# EAGLE design +XPanel (EAGLE 9.5.1)
DESIGNER: Reid Collins; PART_NUMBER: 68-0006; PROJECT: CougSat-1: +X Panel; REV: 1.1.1
Assembly variants: Main

## Sheet 1 of 4
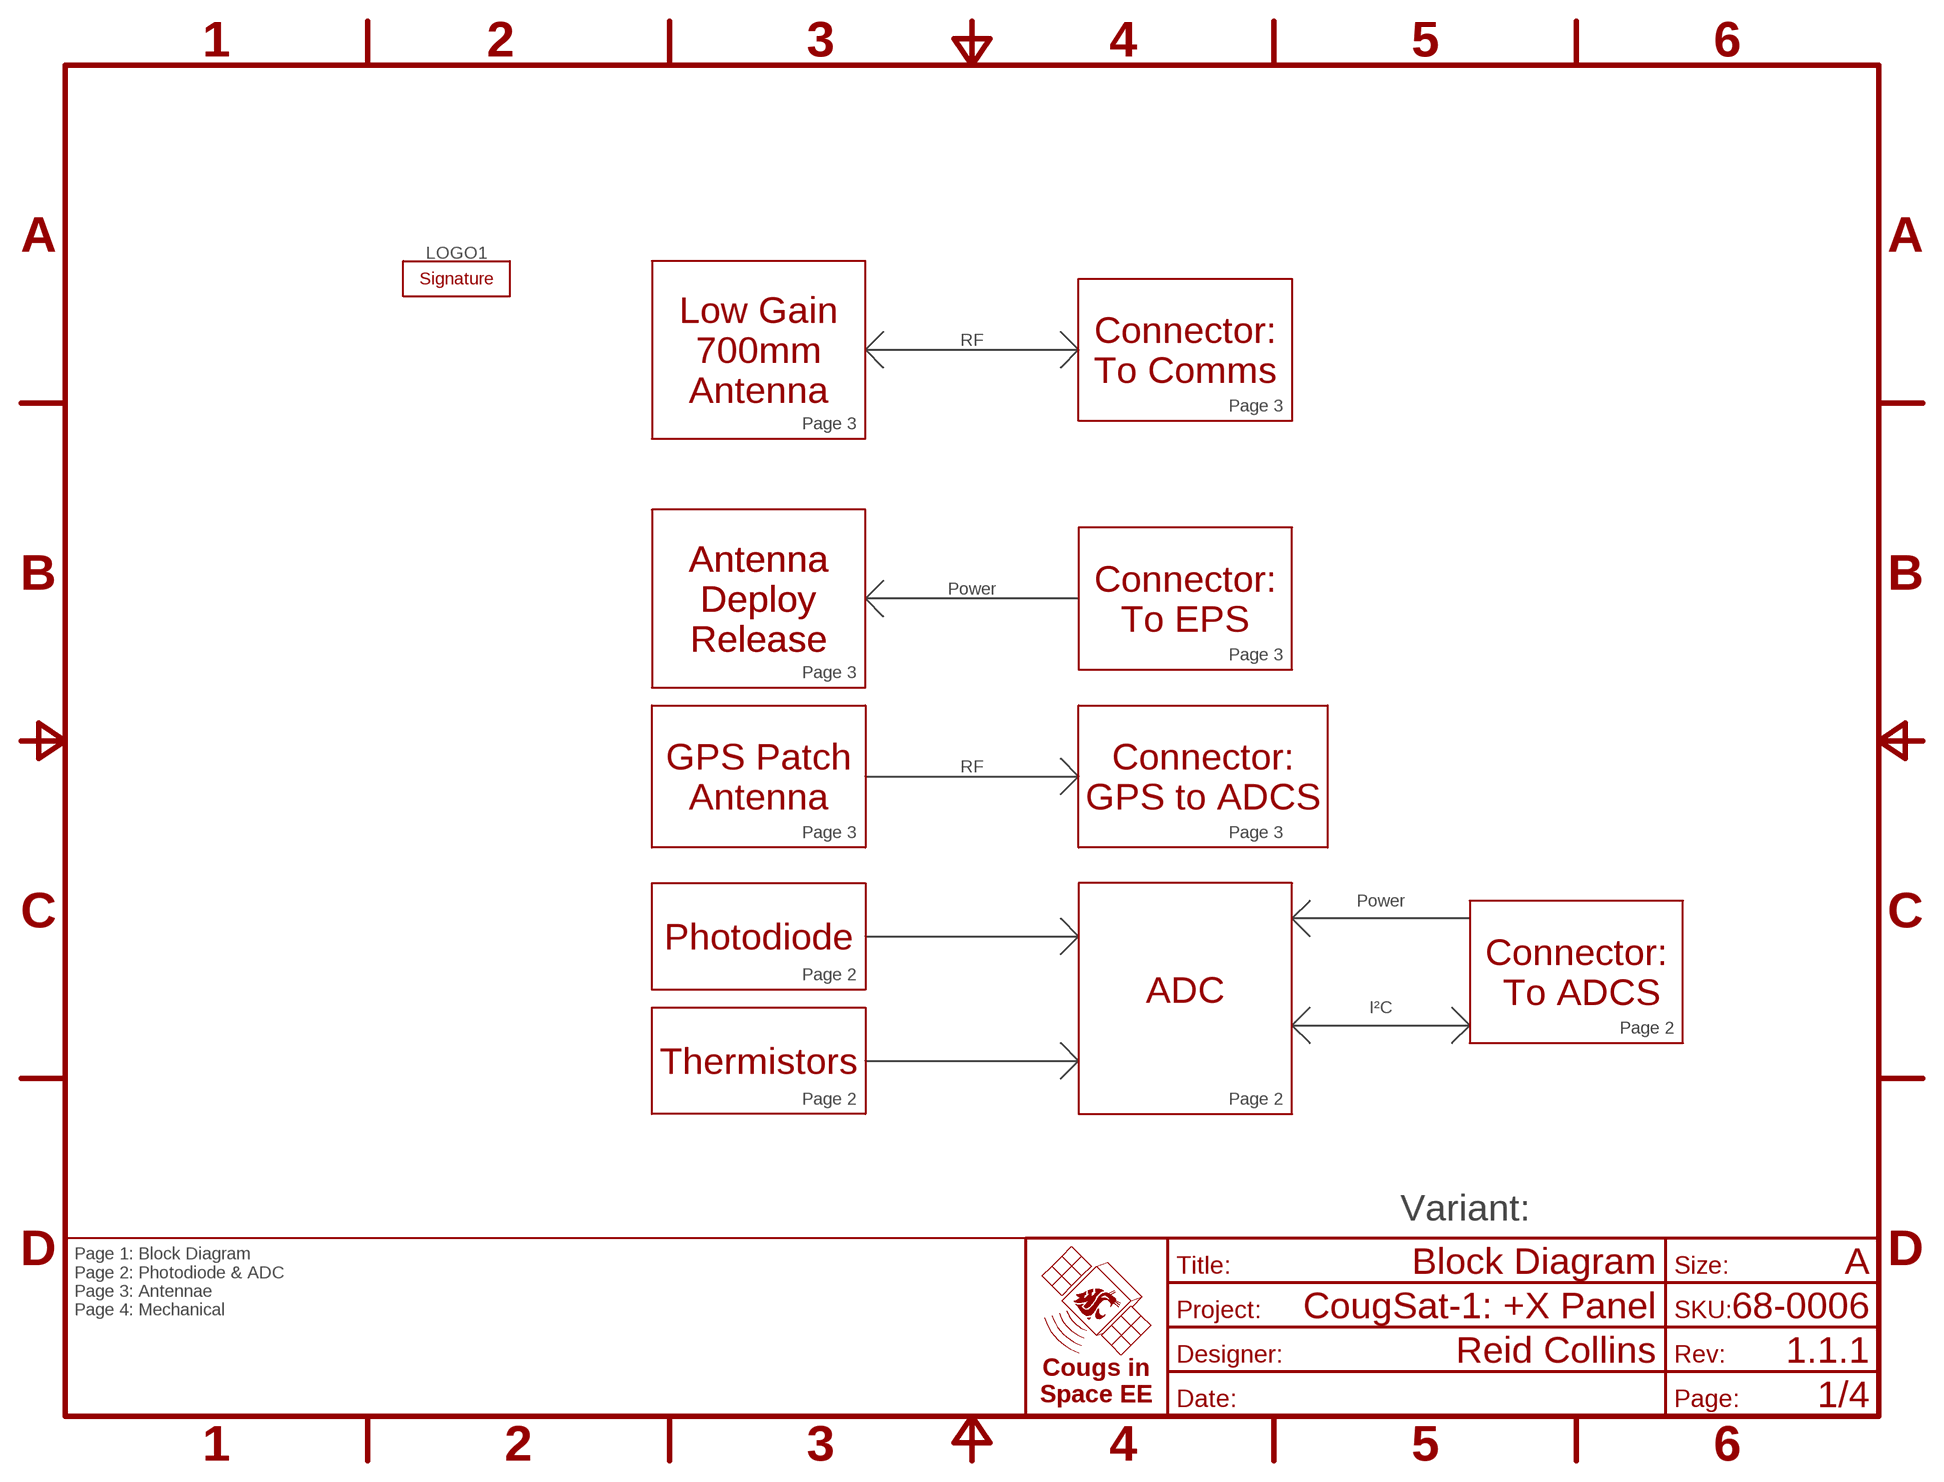
[diagram p0: schematic, sheet 1]
FRAME1 (FRAME-A): TITLE: Block Diagram

### Parts
LOGO1  SIGNATUREJAYSON  [SIGN-JAYSON]

### Notes on the sheet
- RF
- Low Gain
  700mm
  Antenna
- Connector:
  To Comms
- Page 3
- Page 3
- Power
- Antenna
  Deploy
  Release
- Antenna
  Deploy
  Release
- Connector:
  To EPS
- Page 3
- Page 3
- RF
- GPS Patch
  Antenna
- Connector:
  GPS to ADCS
- Page 3 | Page 3
- Power
- Photodiode
- Connector:
   To ADCS
- Page 2
- ADC
- I²C
- Page 2
- Thermistors
- Page 2 | Page 2
- Variant:
- Page 1: Block Diagram
  Page 2: Photodiode & ADC
  Page 3: Antennae
  Page 4: Mechanical

## Sheet 2 of 4
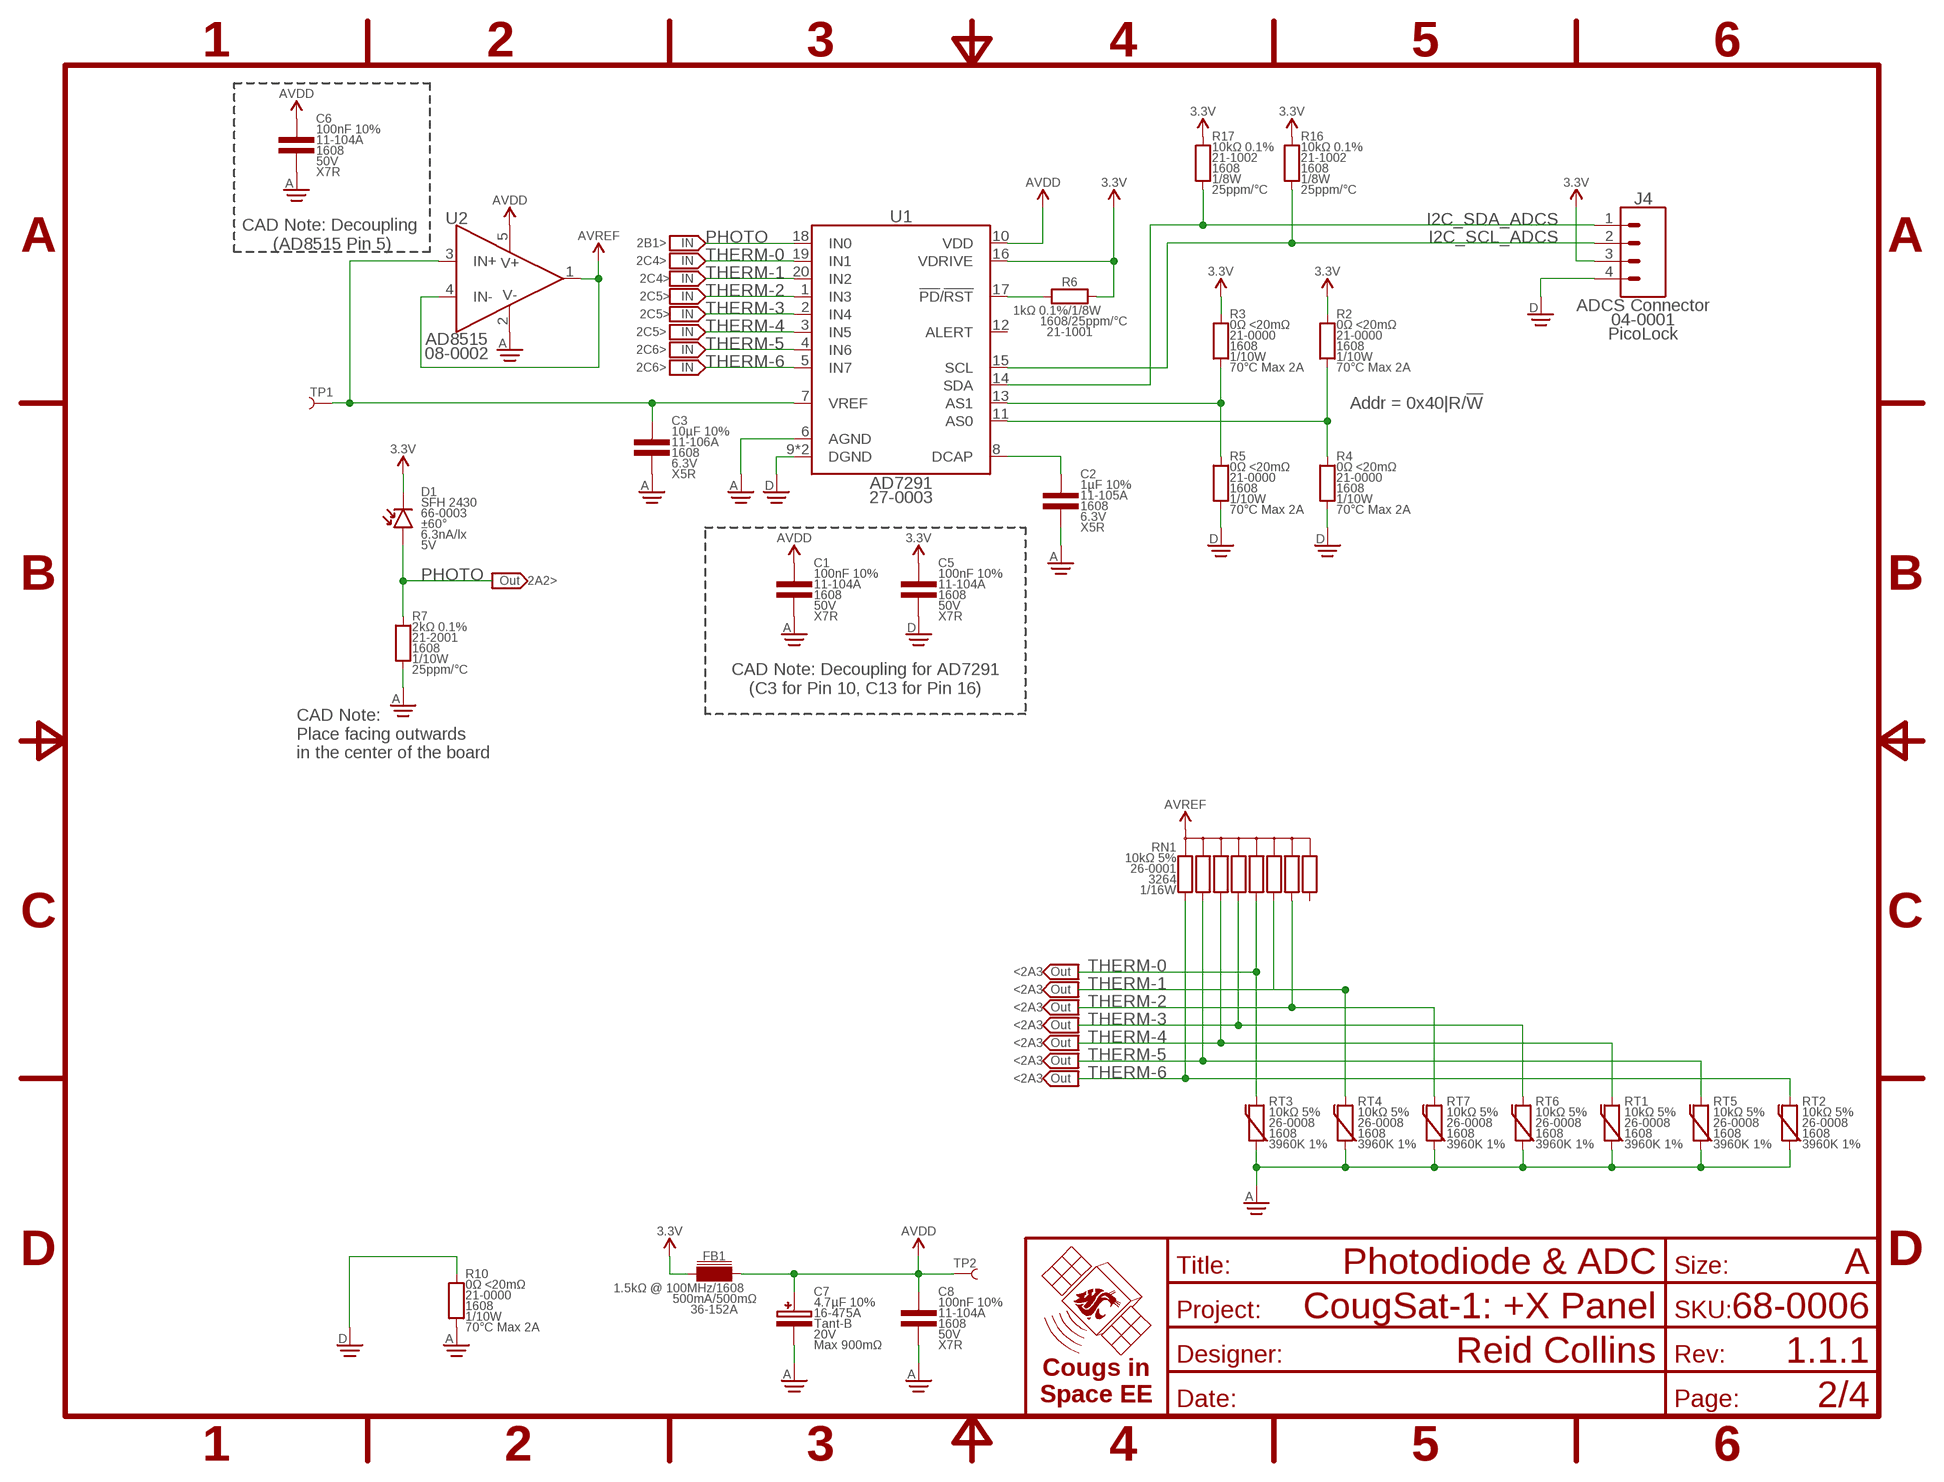
[diagram p1: schematic, sheet 2]
FRAME2 (FRAME-A): TITLE: Photodiode & ADC

### Parts
C1  100nF 10%  CAP-V-100NF-1608  [1608]
C2  1µF 10%  CAP-V-1UF-1608  [1608]
C3  10µF 10%  CAP-V-10UF-1608  [1608]
C5  100nF 10%  CAP-V-100NF-1608  [1608]
C6  100nF 10%  CAP-V-100NF-1608  [1608]
C7  4.7µF 10%  CAP-POL-V-4.7UF-4028  [4028-POL]
C8  100nF 10%  CAP-V-100NF-1608  [1608]
D1  SFH 2430  PHOTODIODE-SFH2430  [SFH2430]
FB1  1.5kΩ @ 100MHz  CHOKE-H-1.5K-1608  [1608]
J4  ADCS Connector  1X04-PICOLOCK  [PICOLOCK1.5-04]
R2  0Ω <20mΩ  RES-V-0-1608  [1608]
R3  0Ω <20mΩ  RES-V-0-1608  [1608]
R4  0Ω <20mΩ  RES-V-0-1608  [1608]  (not fitted in variant Main)
R5  0Ω <20mΩ  RES-V-0-1608  [1608]  (not fitted in variant Main)
R6  1kΩ 0.1%  RES-H-1K-1608  [1608]
R7  2kΩ 0.1%  RES-V-2K-1608  [1608]
R10  0Ω <20mΩ  RES-V-0-1608  [1608]
R16  10kΩ 0.1%  RES-V-10K-1608  [1608]  (not fitted in variant Main)
R17  10kΩ 0.1%  RES-V-10K-1608  [1608]  (not fitted in variant Main)
RN1  10kΩ 5%  RES_BUS-10-10K-3264  [3264]
RT1  10kΩ 5%  THERMISTOR-V-10K-1608  [1608]
RT2  10kΩ 5%  THERMISTOR-V-10K-1608  [1608]
RT3  10kΩ 5%  THERMISTOR-V-10K-1608  [1608]
RT4  10kΩ 5%  THERMISTOR-V-10K-1608  [1608]
RT5  10kΩ 5%  THERMISTOR-V-10K-1608  [1608]
RT6  10kΩ 5%  THERMISTOR-V-10K-1608  [1608]
RT7  10kΩ 5%  THERMISTOR-V-10K-1608  [1608]
TP1  TEST_POINT-SMD-C-1.25  [SMD-C-1.25]
TP2  TEST_POINT-SMD-C-1.25  [SMD-C-1.25]
U1  AD7291  [QFN-20-4040]
U2  AD8515  OPAMP-1-AD8515  [SOT23-5]

### Nets
3.3V: C5.1 D1.C FB1.1 J4.3 R2.2 R3.2 R6.2 R16.2 R17.2 U1.16(VDRIVE)
ADC_AS0: R2.1 R4.2 U1.11(AS0)
ADC_AS1: R3.1 R5.2 U1.13(AS1)
AGND: C1.2 C2.2 C3.2 C6.2 C7.C C8.2 R7.1 R10.1 RT1.1 RT2.1 RT3.1 RT4.1 RT5.1 RT6.1 RT7.1 U1.6(AGND) U2.2(V-)
AVDD: C1.1 C6.1 C7.A C8.1 FB1.2 TP2.1 U1.10(VDD) U2.5(V+)
AVREF: RN1.5(C) RN1.10(C) U2.1(OUT) U2.4(IN-)
AVREF_UNBUF: C3.1 TP1.1 U1.7(VREF) U2.3(IN+)
DCAP: C2.1 U1.8(DCAP)
DGND: C5.2 J4.4 R4.1 R5.1 R10.2 U1.9(DGND) U1.PAD(DGND)
I2C_SCL_ADCS: J4.2 R16.1 U1.15(SCL)
I2C_SDA_ADCS: J4.1 R17.1 U1.14(SDA)
PD_RST: R6.1 U1.17(!PD!/!RST)
PHOTO: D1.A R7.2 U1.18(IN0)
THERM-0: RN1.6 RT3.2 U1.19(IN1)
THERM-1: RN1.7 RT4.2 U1.20(IN2)
THERM-2: RN1.8 RT7.2 U1.1(IN3)
THERM-3: RN1.4 RT6.2 U1.2(IN4)
THERM-4: RN1.3 RT1.2 U1.3(IN5)
THERM-5: RN1.2 RT5.2 U1.4(IN6)
THERM-6: RN1.1 RT2.2 U1.5(IN7)
Unconnected: RN1.9 U1.12(ALERT)

### Notes on the sheet
- CAD Note: Decoupling 
  (AD8515 Pin 5)
- 2B1>
- 2C4>
- 2C4>
- 2C5>
- 2C5>
- 2C5>
- 2C6>
- 2C6>
- Addr = 0x40|R/!W
- 2A2>
- CAD Note: Decoupling for AD7291
  (C3 for Pin 10, C13 for Pin 16)
- CAD Note: 
  Place facing outwards 
  in the center of the board
- <2A3
- <2A3
- <2A3
- <2A3
- <2A3
- <2A3
- <2A3

## Sheet 3 of 4
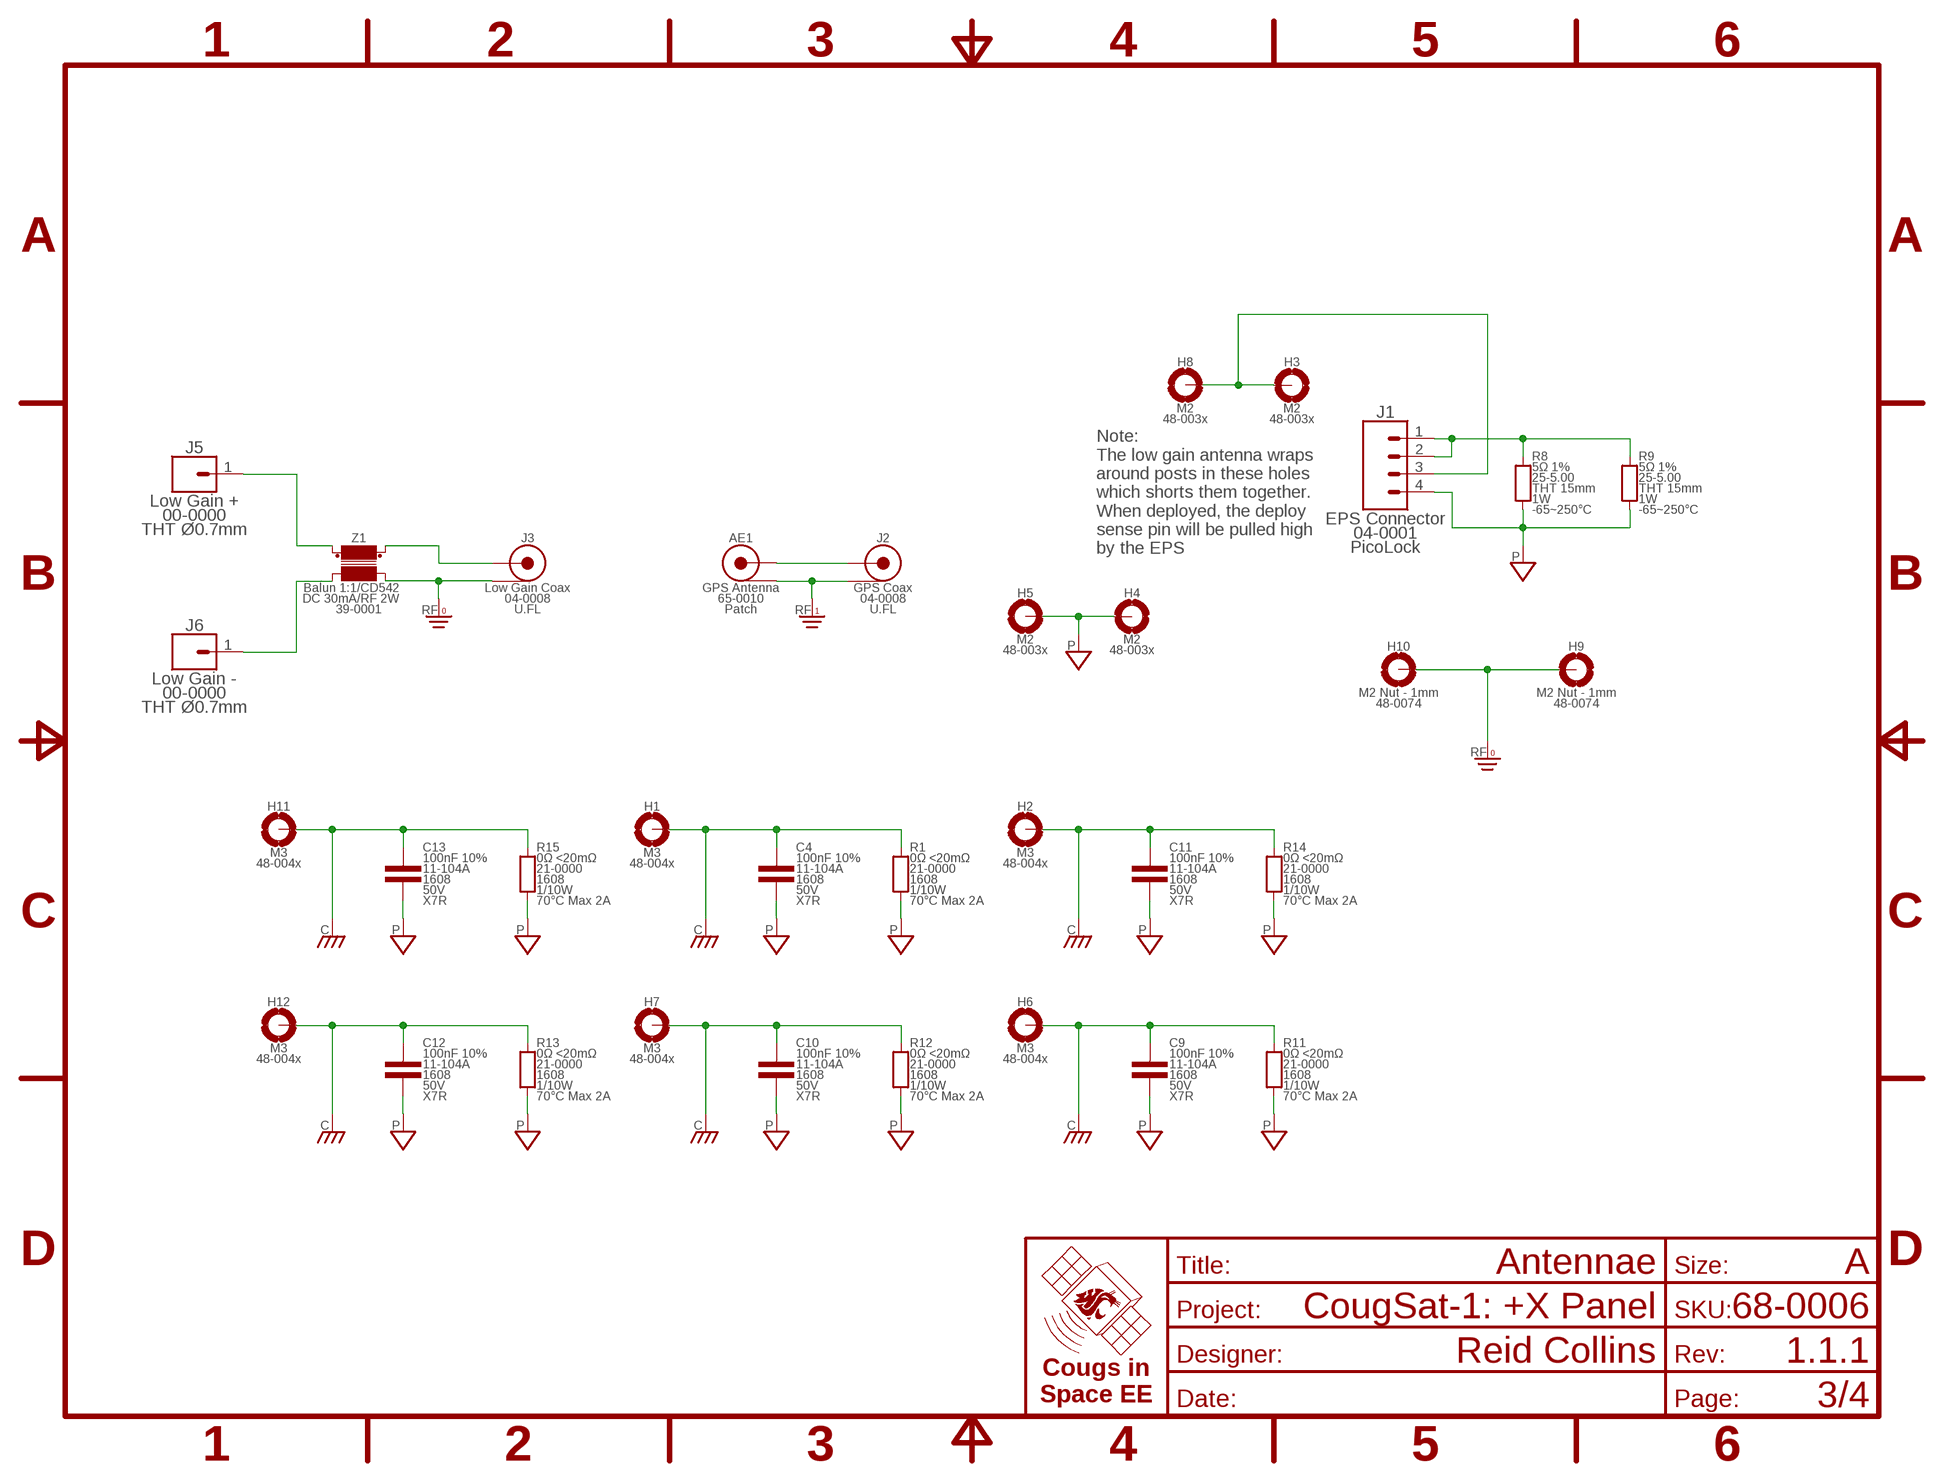
[diagram p2: schematic, sheet 3]
FRAME3 (FRAME-A): TITLE: Antennae

### Parts
AE1  GPS Antenna  ANTENNA-GPSPATCH  [ANTENNA-GPS]
C4  100nF 10%  CAP-V-100NF-1608  [1608]
C9  100nF 10%  CAP-V-100NF-1608  [1608]
C10  100nF 10%  CAP-V-100NF-1608  [1608]
C11  100nF 10%  CAP-V-100NF-1608  [1608]
C12  100nF 10%  CAP-V-100NF-1608  [1608]
C13  100nF 10%  CAP-V-100NF-1608  [1608]
H1  M3  MOUNTING_HOLE-3.3  [MOUNTING_HOLE-3.3]
H2  M3  MOUNTING_HOLE-3.3  [MOUNTING_HOLE-3.3]
H3  M2  MOUNTING_HOLE-2.2  [MOUNTING_HOLE-2.2]
H4  M2  MOUNTING_HOLE-2.2  [MOUNTING_HOLE-2.2]
H5  M2  MOUNTING_HOLE-2.2  [MOUNTING_HOLE-2.2]
H6  M3  MOUNTING_HOLE-3.3  [MOUNTING_HOLE-3.3]
H7  M3  MOUNTING_HOLE-3.3  [MOUNTING_HOLE-3.3]
H8  M2  MOUNTING_HOLE-2.2  [MOUNTING_HOLE-2.2]
H9  M2 Nut - 1mm  MOUNTING_HOLE-1MM-M2_NUT  [MOUNTING_HOLE-M2_NUT]
H10  M2 Nut - 1mm  MOUNTING_HOLE-1MM-M2_NUT  [MOUNTING_HOLE-M2_NUT]
H11  M3  MOUNTING_HOLE-3.3  [MOUNTING_HOLE-3.3]
H12  M3  MOUNTING_HOLE-3.3  [MOUNTING_HOLE-3.3]
J1  EPS Connector  1X04-PICOLOCK  [PICOLOCK1.5-04]
J2  GPS Coax  COAX-U.FL  [U.FL]
J3  Low Gain Coax  COAX-U.FL  [U.FL]
J5  Low Gain +  1X01-THT-0.7  [THT-0.7]
J6  Low Gain -  1X01-THT-0.7  [THT-0.7]
R1  0Ω <20mΩ  RES-V-0-1608  [1608]
R8  5Ω 1%  RES-V-5R-THT-15MM  [THT-15MM]
R9  5Ω 1%  RES-V-5R-THT-15MM  [THT-15MM]
R11  0Ω <20mΩ  RES-V-0-1608  [1608]
R12  0Ω <20mΩ  RES-V-0-1608  [1608]
R13  0Ω <20mΩ  RES-V-0-1608  [1608]
R14  0Ω <20mΩ  RES-V-0-1608  [1608]
R15  0Ω <20mΩ  RES-V-0-1608  [1608]
Z1  Balun 1:1  BALUN-ADTL1-12+-CD542  [CD542]

### Nets
CHASSIS: C4.1 C9.1 C10.1 C11.1 C12.1 C13.1 H1.1(MOUNT) H1.V1(MOUNT) H1.V2(MOUNT) H1.V3(MOUNT) H1.V4(MOUNT) H1.V5(MOUNT) H1.V6(MOUNT) H1.V7(MOUNT) H1.V8(MOUNT) H1.V9(MOUNT) H1.V10(MOUNT) H2.1(MOUNT) H2.V1(MOUNT) H2.V2(MOUNT) H2.V3(MOUNT) H2.V4(MOUNT) H2.V5(MOUNT) H2.V6(MOUNT) H2.V7(MOUNT) H2.V8(MOUNT) H2.V9(MOUNT) H2.V10(MOUNT) H6.1(MOUNT) H6.V1(MOUNT) H6.V2(MOUNT) H6.V3(MOUNT) H6.V4(MOUNT) H6.V5(MOUNT) H6.V6(MOUNT) H6.V7(MOUNT) H6.V8(MOUNT) H6.V9(MOUNT) H6.V10(MOUNT) H7.1(MOUNT) H7.V1(MOUNT) H7.V2(MOUNT) H7.V3(MOUNT) H7.V4(MOUNT) H7.V5(MOUNT) H7.V6(MOUNT) H7.V7(MOUNT) H7.V8(MOUNT) H7.V9(MOUNT) H7.V10(MOUNT) H11.1(MOUNT) H11.V1(MOUNT) H11.V2(MOUNT) H11.V3(MOUNT) H11.V4(MOUNT) H11.V5(MOUNT) H11.V6(MOUNT) H11.V7(MOUNT) H11.V8(MOUNT) H11.V9(MOUNT) H11.V10(MOUNT) H12.1(MOUNT) H12.V1(MOUNT) H12.V2(MOUNT) H12.V3(MOUNT) H12.V4(MOUNT) H12.V5(MOUNT) H12.V6(MOUNT) H12.V7(MOUNT) H12.V8(MOUNT) H12.V9(MOUNT) H12.V10(MOUNT) R1.2 R11.2 R12.2 R13.2 R14.2 R15.2
DEPLOYABLE: J1.1 J1.2 R8.2 R9.2
GPS_COAX [50Ohm]: AE1.CENTER J2.CENTER
LOW_GAIN_COAX [50Ohm]: J3.CENTER Z1.6(SECONDARY-DOT)
LOW_GAIN_N [50Ohm]: J6.1 Z1.3(PRIMARY)
LOW_GAIN_P [50Ohm]: J5.1 Z1.1(PRIMARY-DOT)
PGND: C4.2 C9.2 C10.2 C11.2 C12.2 C13.2 H4.1(MOUNT) H4.V1(MOUNT) H4.V2(MOUNT) H4.V3(MOUNT) H4.V4(MOUNT) H4.V5(MOUNT) H4.V6(MOUNT) H4.V7(MOUNT) H4.V8(MOUNT) H5.1(MOUNT) H5.V1(MOUNT) H5.V2(MOUNT) H5.V3(MOUNT) H5.V4(MOUNT) H5.V5(MOUNT) H5.V6(MOUNT) H5.V7(MOUNT) H5.V8(MOUNT) J1.4 R1.1 R8.1 R9.1 R11.1 R12.1 R13.1 R14.1 R15.1
RFGND-0 [50Ohm]: H9.1(MOUNT) H9.V1(MOUNT) H9.V2(MOUNT) H9.V3(MOUNT) H9.V4(MOUNT) H9.V5(MOUNT) H9.V6(MOUNT) H9.V7(MOUNT) H9.V8(MOUNT) H10.1(MOUNT) H10.V1(MOUNT) H10.V2(MOUNT) H10.V3(MOUNT) H10.V4(MOUNT) H10.V5(MOUNT) H10.V6(MOUNT) H10.V7(MOUNT) H10.V8(MOUNT) J3.SHIELD@1(SHIELD) J3.SHIELD@2(SHIELD) J3.SHIELD@13(SHIELD) Z1.4(SECONDARY)
RFGND-1 [50Ohm]: AE1.GND(SHIELD) J2.SHIELD@1(SHIELD) J2.SHIELD@2(SHIELD) J2.SHIELD@13(SHIELD)
SENSE: H3.1(MOUNT) H3.V1(MOUNT) H3.V2(MOUNT) H3.V3(MOUNT) H3.V4(MOUNT) H3.V5(MOUNT) H3.V6(MOUNT) H3.V7(MOUNT) H3.V8(MOUNT) H8.1(MOUNT) H8.V1(MOUNT) H8.V2(MOUNT) H8.V3(MOUNT) H8.V4(MOUNT) H8.V5(MOUNT) H8.V6(MOUNT) H8.V7(MOUNT) H8.V8(MOUNT) J1.3

### Notes on the sheet
- Note:
  The low gain antenna wraps
  around posts in these holes
  which shorts them together.
  When deployed, the deploy
  sense pin will be pulled high
  by the EPS

## Sheet 4 of 4
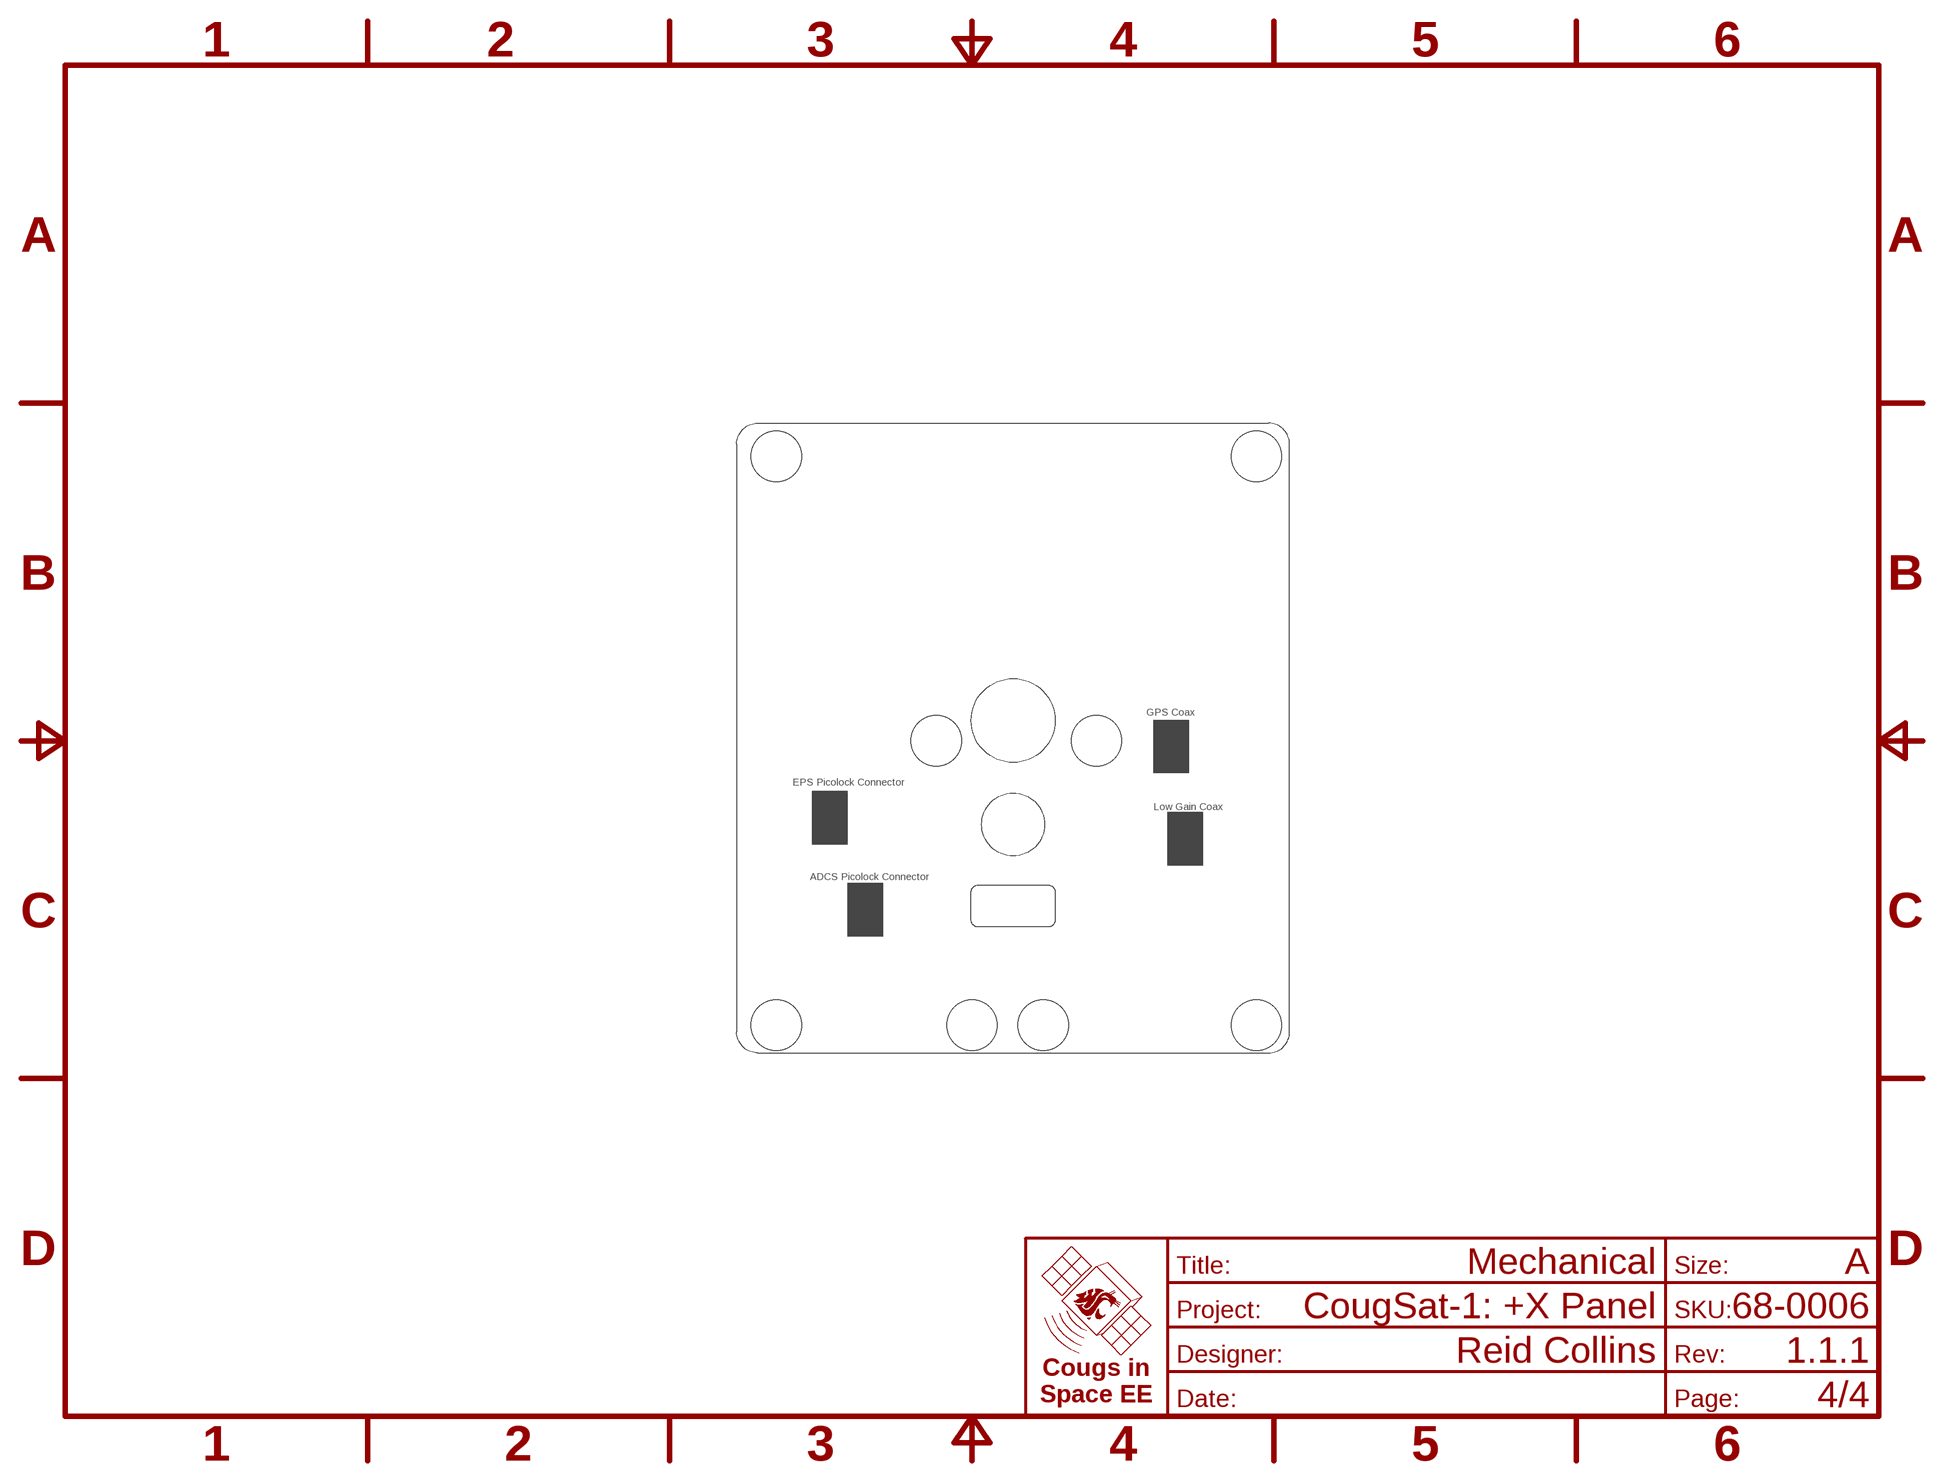
[diagram p3: schematic, sheet 4]
FRAME4 (FRAME-A): TITLE: Mechanical

### Notes on the sheet
- GPS Coax
- EPS Picolock Connector
- Low Gain Coax
- ADCS Picolock Connector

## Library data of the parts
AE1 = CougsInSpace-RF:ANTENNA: Antenna; PACKAGE: Patch; SKU: 65-0010
C1 C4-C6 C8-C13 = CougsInSpace-Capacitors:CAP-V: Capacitor - Vertical Orientation; PACKAGE: 1608; SKU: 11-104A; TEMP: X7R; VOLTAGE: 50V
C2 = CougsInSpace-Capacitors:CAP-V: Capacitor - Vertical Orientation; PACKAGE: 1608; SKU: 11-105A; TEMP: X5R; VOLTAGE: 6.3V
C3 = CougsInSpace-Capacitors:CAP-V: Capacitor - Vertical Orientation; PACKAGE: 1608; SKU: 11-106A; TEMP: X5R; VOLTAGE: 6.3V
C7 = CougsInSpace-Capacitors:CAP-POL-V: Capacitor Polarized - Vertical Orientation; ESR: Max 900mΩ; PACKAGE: Tant-B; SKU: 16-475A; VOLTAGE: 20V
D1 = CougsInSpace-Sensors:PHOTODIODE: Photodiode; HALF_ANGLE: ±60°; SENSITIVITY: 6.3nA/lx; SKU: 66-0003; VR: 5V
FB1 = CougsInSpace-Coils:CHOKE-H: Choke (Ferrite Bead) Horizontal; CURRENT: 500mA; DCR: 500mΩ; PACKAGE: 1608; SKU: 36-152A
H1 H2 H6 H7 H11 H12 = CougsInSpace-Hardware:MOUNTING_HOLE: Mounting Hole; SKU: 48-004x
H3-H5 H8 = CougsInSpace-Hardware:MOUNTING_HOLE: Mounting Hole; SKU: 48-003x
H9 H10 = CougsInSpace-Hardware:MOUNTING_HOLE: Mounting Hole; SKU: 48-0074
J1 J4 = CougsInSpace-Connectors:1X04: Generic Connector - 4 Conductor; PACKAGE: PicoLock; SKU: 04-0001
J2 J3 = CougsInSpace-Connectors:COAX: Coax Connector; PACKAGE: U.FL; SKU: 04-0008
J5 J6 = CougsInSpace-Connectors:1X01: Generic Connector - 1 Conductor; PACKAGE: THT Ø0.7mm; SKU: 00-0000
LOGO1 = CougsInSpace-Aesthetics:SIGNATURE: Designer's (Artist's) Signature
R1-R5 R10-R15 = CougsInSpace-Resistors:RES-V: Resistor Vertical; PACKAGE: 1608; POWER: 1/10W; SKU: 21-0000; TEMP: 70°C Max 2A
R6 = CougsInSpace-Resistors:RES-H: Resistor Horizontal; PACKAGE: 1608; POWER: 1/8W; SKU: 21-1001; TEMP: 25ppm/°C
R7 = CougsInSpace-Resistors:RES-V: Resistor Vertical; PACKAGE: 1608; POWER: 1/10W; SKU: 21-2001; TEMP: 25ppm/°C
R8 R9 = CougsInSpace-Resistors:RES-V: Resistor Vertical; PACKAGE: THT 15mm; POWER: 1W; SKU: 25-5.00; TEMP: -65~250°C
R16 R17 = CougsInSpace-Resistors:RES-V: Resistor Vertical; PACKAGE: 1608; POWER: 1/8W; SKU: 21-1002; TEMP: 25ppm/°C
RN1 = CougsInSpace-Resistors:RES_BUS-10: Resistor Bussed Array All resistors share a common terminal; PACKAGE: 3264; POWER: 1/16W; SKU: 26-0001; TEMP: 200ppm/°C
RT1-RT7 = CougsInSpace-Resistors:THERMISTOR-V: Thermistor Vertical; B2585: 3960K 1%; PACKAGE: 1608; SKU: 26-0008
TP1 TP2 = CougsInSpace-Connectors:TEST_POINT: Test Point Used to probe points in a circuit for debugging or general measurement
U1 = CougsInSpace-IC-Conversion:AD7291: AD7291 12b ADC with 8-single ended channels. I²C interface; SKU: 27-0003
U2 = CougsInSpace-IC-Amplifiers:OPAMP-1: Operational Amplifier - Single; SKU: 08-0002
Z1 = CougsInSpace-Coils:BALUN: Balun; CURRENT: DC 30mA; PACKAGE: CD542; POWER: RF 2W; SKU: 39-0001

## Net classes
1 50Ohm: width 0.3 mm, clearance 0.25 mm

## Board
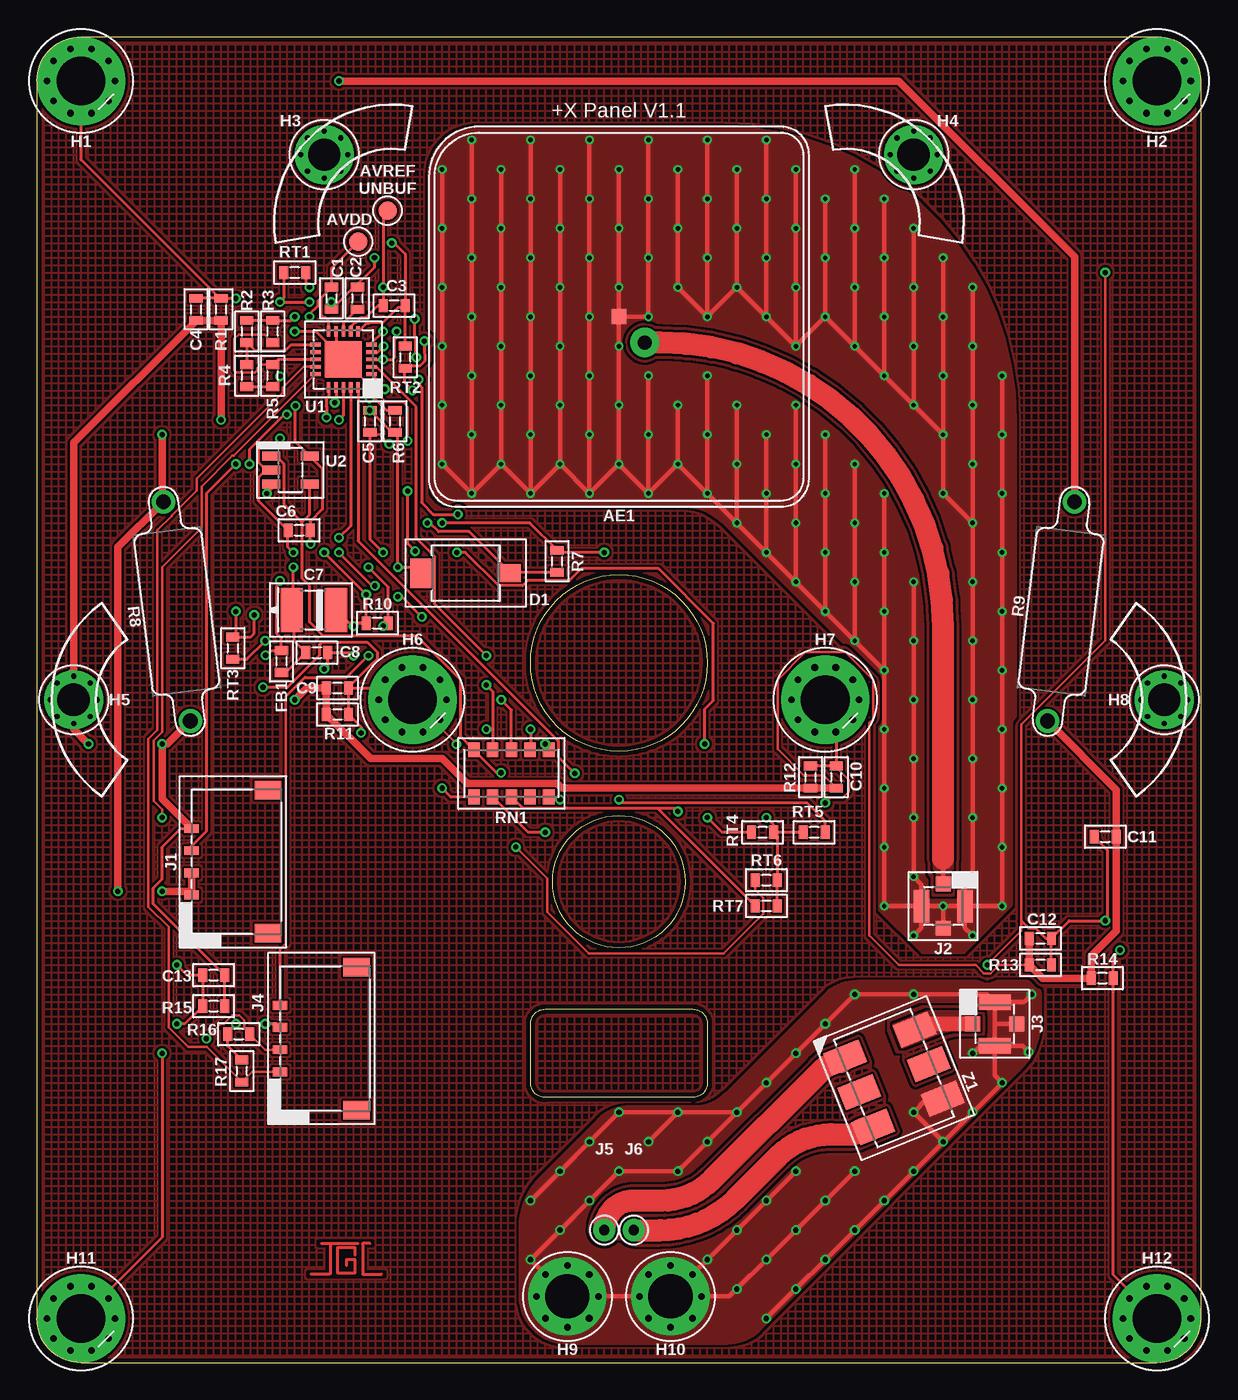
[diagram p4: board, top side]
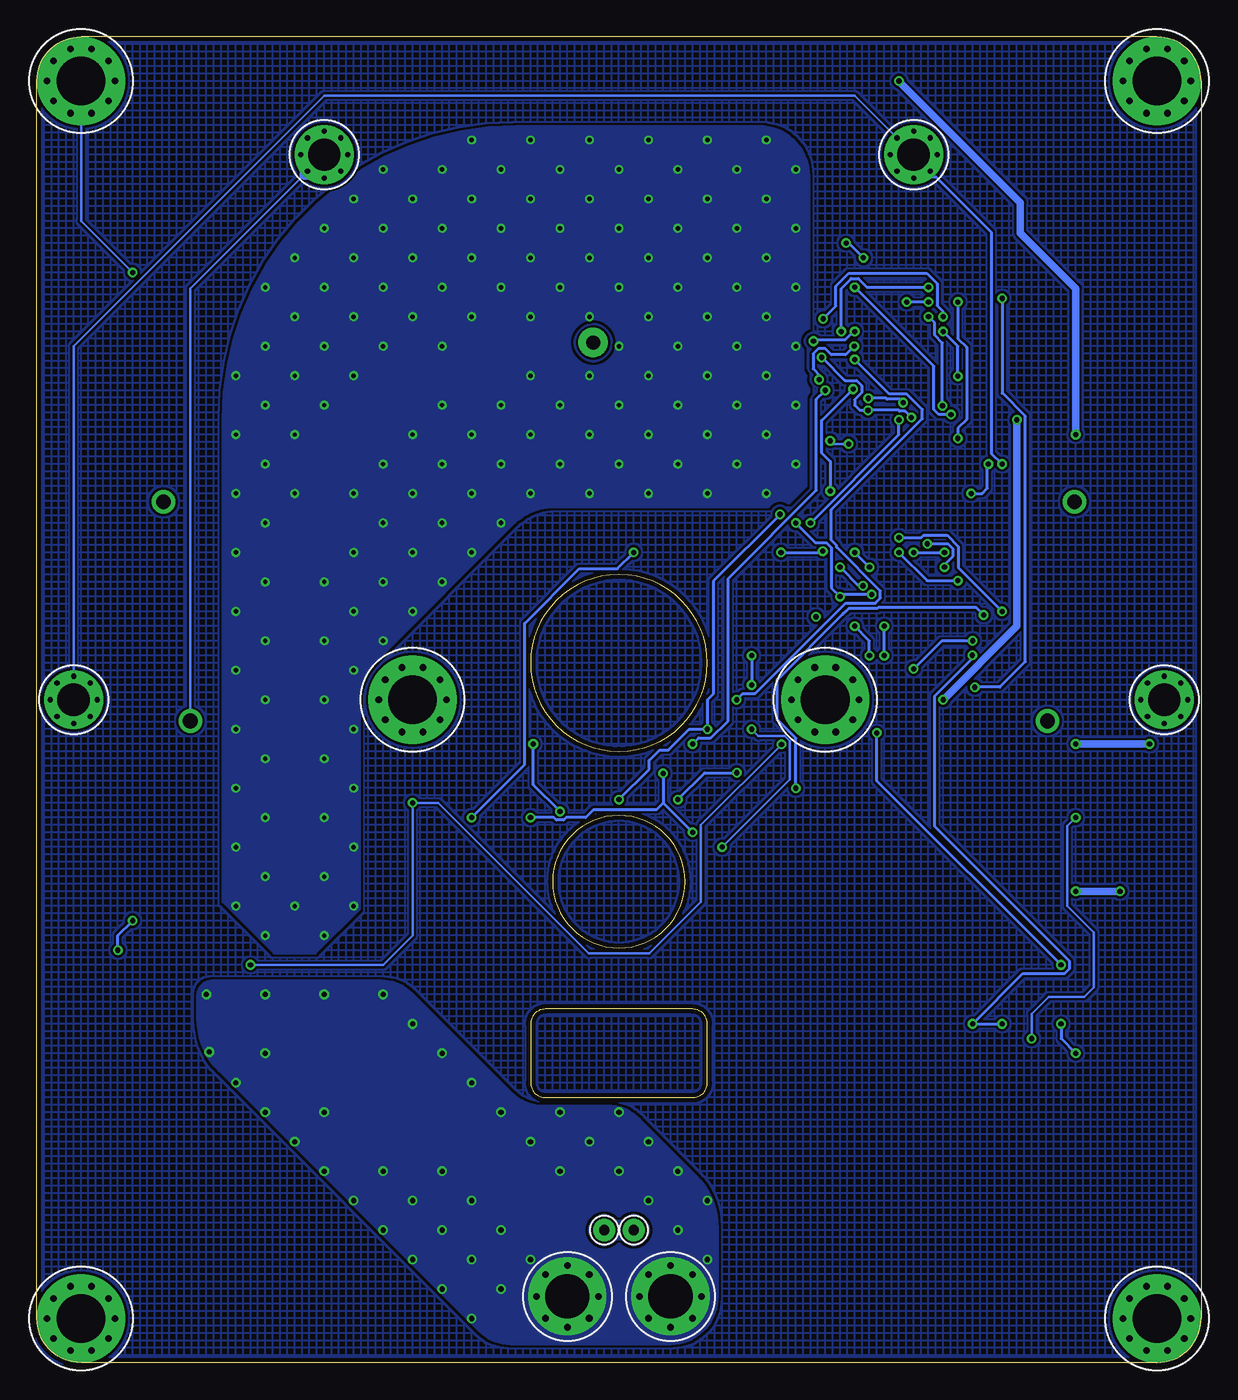
[diagram p5: board, bottom side, seen from below]

Size 79 x 90 mm. Coordinates in mm from the lower left corner, seen from the top.
Outline: 79,3 79,87 arc90 76,90 3,90 arc90 0,87 0,3 arc90 3,0 76,0 arc90 79,3
Outline: 44.5,18 34.5,18 arc-90 33.5,19 33.5,23 arc-90 34.5,24 44.5,24 arc-90 45.5,23 45.5,19 arc-90 44.5,18
Outline: 35,32.65 arc-180 44,32.65 arc-180 35,32.65
Outline: 33.5,47.5 arc-180 45.5,47.5 arc-180 33.5,47.5
Copper layers (1*16): Top 0.035mm / dielectric 1.6mm / Bottom 0.035mm
Design rules "CougsInSpace": minimum track width 0.16mm, minimum drill 0.3mm, track to track 0.16mm, track to pad 0.16mm, pad to pad 0.16mm, via to via 0.16mm, smd to smd 0mil, copper to edge 0.3mm, drill to drill 0.3mm, minimum pad ring 0.15mm, minimum via ring 0.15mm, stop-mask expansion 0mil, vias tented up to drill 1mm, thermal gap 0.25mm
tKeepout: area 17,16 to 32,40; 16 lines

### Footprints (pad centres in the part's own frame; a part is rotated, then mirrored left to right if it is on the bottom)
ANTENNA-GPS = drill 0.95 pad 2: CENTER 1.75,-1.75 | smd 1 x 1: GND 0,0
1608 = smd 0.6 x 0.9: 1 -0.75,0; 2 0.75,0
4028-POL = smd 1.5 x 3: A 1.5,0; C -1.5,0
SFH2430 = smd 1.4 x 1.2: A -3.05,0 | smd 1.4 x 2: C 3.05,0
MOUNTING_HOLE-3.3 = drill 3.3 pad 6: 1 0,0 | drill 0.45 pad 0.6: V1 2.3,0; V2 1.861,1.352; V3 0.711,2.187; V4 -0.711,2.187; V5 -1.861,1.352; V6 -2.3,0; V7 -1.861,-1.352; V8 -0.711,-2.187; V9 0.711,-2.187; V10 1.861,-1.352
MOUNTING_HOLE-2.2 = drill 2.2 pad 4: 1 0,0 | drill 0.35 pad 0.6: V1 1.6,0; V2 1.131,1.131; V3 0,1.6; V4 -1.131,1.131; V5 -1.6,0; V6 -1.131,-1.131; V7 0,-1.6; V8 1.131,-1.131
MOUNTING_HOLE-M2_NUT = drill 3 pad 5.3: 1 0,0 | drill 0.45 pad 0.6: V1 2.1,0; V2 1.485,1.485; V3 0,2.1; V4 -1.485,1.485; V5 -2.1,0; V6 -1.485,-1.485; V7 0,-2.1; V8 1.485,-1.485
PICOLOCK1.5-04 = smd 0.6 x 1: 1 2.25,0; 2 0.75,0; 3 -0.75,0; 4 -2.25,0 | smd 1.25 x 1.8: PAD@1 4.855,5.2; PAD@2 -4.855,5.2
U.FL = smd 1 x 1: CENTER 0,-1.5; SHIELD@2 0,1.5 | smd 1.05 x 2.2: SHIELD@1 -1.475,0; SHIELD@13 1.475,0
THT-0.7 = drill 0.7 pad 1.5: 1 0,0
THT-15MM = drill 1 pad 1.6: 1 -7.5,0; 2 7.5,0
3264 = smd 0.79 x 1: 1 -2.54,-1.6; 2 -1.27,-1.6; 3 0,-1.6; 4 1.27,-1.6; 5 2.54,-1.6; 6 2.54,1.6; 7 1.27,1.6; 8 0,1.6; 9 -1.27,1.6; 10 -2.54,1.6
SMD-C-1.25 = smd 1.25 x 1.25: 1 0,0
QFN-20-4040 = smd 0.7 x 0.25: 1 -1.9,1; 2 -1.9,0.5; 3 -1.9,0; 4 -1.9,-0.5; 5 -1.9,-1; 11 1.9,-1; 12 1.9,-0.5; 13 1.9,0; 14 1.9,0.5; 15 1.9,1 | smd 0.25 x 0.7: 6 -1,-1.9; 7 -0.5,-1.9; 8 0,-1.9; 9 0.5,-1.9; 10 1,-1.9; 16 1,1.9; 17 0.5,1.9; 18 0,1.9; 19 -0.5,1.9; 20 -1,1.9 | smd 2.5 x 2.5: PAD 0,0
SOT23-5 = smd 1.22 x 0.62: 1 -1.31,0.95; 2 -1.31,0; 3 -1.31,-0.95; 4 1.31,-0.95; 5 1.31,0.95
CD542 = smd 1.65 x 2.54: 1 -2.54,-2.54; 2 0,-2.54; 3 2.54,-2.54; 4 2.54,2.54; 5 0,2.54; 6 -2.54,2.54

### Placement (x,y rotation side)
AE1  39.5,71 0 top
C1  20,72.25 270 top
C2  21.75,72.25 90 top
C3  24.25,71.75 0 top
C4  10.8,71.5 270 top
C5  22.6,63.9 270 top
C6  17.8,56.5 180 top
C7  18.8,51.1 180 top
C8  19,48.2 0 top
C9  20.4,45.8 180 top
C10  54.25,39.75 270 top
C11  72.5,35.7 0 top
C12  68.1,28.8 180 top
C13  12,26.3 0 top
D1  29.1,53.6 180 top
FB1  16.6,47.6 270 top
H1  3,87 0 top
H2  76,87 0 top
H3  19.5,82 0 top
H4  59.5,82 0 top
H5  2.5,45 0 top
H6  25.5,45 0 top
H7  53.5,45 0 top
H8  76.5,45 0 top
H9  36,4.5 0 top
H10  43,4.5 0 top
H11  3,3 0 top
H12  76,3 0 top
J1  10.5,34 270 top
J2  61.5,31 180 top
J3  65,23 270 top
J4  16.5,22 270 top
J5  38.5,9 0 top
J6  40.5,9 0 top
LOGO1  21,7 0 top
R1  12.5,71.5 90 top
R2  14.25,70 90 top
R3  16,70 90 top
R4  14.25,67 90 top
R5  16,67 90 top
R6  24.3,63.9 270 top
R7  35.3,54.4 270 top
R8  9.5,51 97 top
R9  69.5,51 83 top
R10  23.1,50.2 0 top
R11  20.4,44 0 top
R12  52.5,39.75 90 top
R13  68.1,27 0 top
R14  72.3,26.1 0 top
R15  12,24.2 180 top
R16  13.7,22.3 180 top
R17  13.9,19.8 90 top
RN1  32.2,40 180 top
RT1  17.5,74 0 top
RT2  25,68.25 270 top
RT3  13.3,48.5 90 top
RT4  49.25,36 180 top
RT5  52.75,36 0 top
RT6  49.5,32.75 180 top
RT7  49.5,31 180 top
TP1  23.8,78.2 0 top
TP2  21.8,76.1 0 top
U1  20.8,68.1 180 top
U2  17.2,60.6 0 top
Z1  58.16,19.31 292 top

### Tracks (layer width: path | path; a pad name or v marks a point on that pad's centre or on a via)
3.3V  (via drill 0.35)
  Top 0.2: R17.2 12.95,21.5 R16.2 12.95,22.45 v13.5,23 | J4.3 16.25,23 v15.5,23 | C5.1 24.1,63.15 R6.2 24.5,62.95 v24.5,54 25.65,54 D1.C | v16.5,53.09 16.5,52.92 16.29,52.71 16.29,49.49 16.6,49.18 FB1.1 15.85,48.35 v15.52,48.02 | R2.2 R3.2 17.25,70.75 v17.5,71 | U1.16 19.8,65.58 19.63,65.41 19.63,64.93 19.66,64.9 v19.66,64.16 | v25.64,70.86 25.64,69.53 25.71,69.46 25.71,68.28 v25.74,68.24 | v22.93,52.73 22.77,52.73 v20.5,55
  Bottom 0.2: v13.5,23 v15.5,23 12.09,26.41 11.5,26.41 9.26,26.41 8.91,26.76 8.91,27.24 18.09,36.41 18.09,45.24 15.52,47.81 v15.52,48.02 | v17.5,71 17.5,71.34 17.91,71.76 17.91,73.24 18.62,73.94 23.89,73.94 24.77,73.06 24.77,71.72 v25.64,70.86 | v22.93,52.73 23.23,52.73 v24.5,54 | v20.5,55 18.59,53.09 v16.5,53.09 | v25.74,68.24 24.17,66.67 23.37,66.67 23.03,66.33 23.03,65.84 23.5,65.37 23.5,65 23.15,64.65 C5.1 20.52,64.65 20.46,64.59 20.09,64.59 v19.66,64.16
  other vias: 22.6,64.65
ADC_AS0
  Top 0.2: U1.11 17.25,69.1 16.84,68.69 14.81,68.69 R2.1 R4.2
ADC_AS1
  Top 0.16: R5.2 15.19,67.75 14.94,67.5 14.94,67.35 14.8,67.21 13.55,67.21 13.41,67.35 13.41,69.5 13.7,69.79 15.46,69.79 R3.1
  Top 0.2: U1.13 16.35,68.1 R5.2
AGND  (via drill 0.35)
  Top 0.2: RT2.1 25,71.65 24.9,71.65 | 24.9,71.65 C3.2 25,75.25 24.25,76 v24.09,76 | 17.02,56.52 15.02,58.53 15.02,60.07 15.48,60.52 | 17.02,56.52 C6.2 | v21.5,48 21.3,48.2 C8.2 19.75,47.34 v19.5,47.09 | v21.5,50 21.7,50.2 R10.1 | R10.1 21.2,50.2 C7.C | R10.1 v22.35,52.15 v19.5,55 | v17.41,55 17.02,55.38 17.02,56.52 | RT5.1 RT4.1 | RT4.1 50.25,35.75 RT6.1 RT7.1 | v27.5,57 33.45,57 R7.1 35.45,55 v38.5,55 | RT4.1 50,36.5 v49.5,37 | v26.13,50.63 24.76,52 v24.5,52 | v19.98,72 20,71.97 C1.2 21.5,73 21.55,73 | 21.55,73 C2.2 | 24.9,71.65 24.52,71.65 23.5,70.63 22.61,70.63 22.56,70.58 22.38,70.58 U1.6 | RT3.1 14.25,47.75 v15.5,49 | 15.48,60.68 15.55,60.6 | U2.2 15.55,60.6 | 15.55,60.6 15.48,60.52 | v18.5,72 v16.5,72 16.75,72.25 RT1.1 | 21.55,73 22.91,74.36 v22.91,75 | 15.48,60.68 15.48,60.52 | 15.48,60.68 15.02,61.13 15.02,61.97 15.17,62.12 15.87,62.12 v16.5,62.75
  Bottom 0.2: v21.5,48 v21.5,50 | v19.5,55 v17.41,55 | v18.5,72 v19.98,72 | v27.5,57 26.17,55.67 25.43,55.67 25.09,55.33 25.09,52.59 v24.5,52 24.35,52.15 v22.35,52.15 | v38.5,55 39.6,53.9 42.19,53.9 45.9,50.19 45.9,40.6 v49.5,37 | v15.5,49 17.59,49 v19.5,47.09 | v22.91,75 23.91,76 v24.09,76 | v16.5,72 16.5,69.51 15.91,68.92 15.91,64.02 16.5,63.44 v16.5,62.75
AVDD  (via drill 0.35)
  Top 0.2: U1.10 19.8,70.73 19.59,70.94 19.44,70.94 19.29,71.09 19.29,72.29 | TP2.1 20,74.3 C1.1 19.29,72.29 | FB1.2 16.9,46.85 C8.1 17.45,49 17.45,50.95 C7.A 17.41,51.2 v17.41,54 | v18.57,55.59 18.55,55.61 C6.1 18.55,57.11 19.38,57.94 19.38,60.68 U2.5 17.55,62.51 v17.55,64.95 | v18.5,71 18.5,71.17 19.09,71.76 19.09,72.09 19.29,72.29
  Bottom 0.2: v18.57,55.59 17.16,55.59 16.82,55.24 16.82,54.76 17.41,54.17 v17.41,54 | v17.55,64.95 17.55,69.22 18.09,69.76 18.09,70.59 v18.5,71
AVREF  (via drill 0.35)
  Top 0.2: U2.4 18.51,57.58 17.99,57.06 | 17.99,57.06 17.99,53.27 18.51,52.75 18.51,50.27 19.44,49.34 25.77,49.34 28.76,46.35 28.76,42.5 RN1.5 31.21,40.05 v31.5,40.05 | 17.99,57.06 16.76,58.29 16.76,61.02 16.23,61.55 U2.1 | RN1.10 35.33,38.4 v35.5,38.23
  Bottom 0.2: v35.5,38.23 33.68,40.05 v31.5,40.05
AVREF_UNBUF  (via drill 0.35)
  Top 0.2: TP1.1 23.5,77.9 v23.5,73 C3.1 23.12,71.75 22.31,70.94 22,70.94 21.67,70.61 21.57,70.61 21.3,70.34 U1.7 | U2.3 15.89,59.28 v15.61,59 | v14.43,61 14.43,62 16.8,64.36 v16.96,64.36
  Bottom 0.2: v23.5,73 18.14,67.64 18.14,64.71 17.79,64.36 v16.96,64.36 | v14.43,61 14.5,60.94 14.5,59.36 14.86,59 v15.61,59
BALANCING_TOP
  pour Top (rank 6, hatched): 79,5.3 arc-90 79.1,5.2 79.1,2.2 arc-90 76.9,0 75.1,0 3.2,0 arc-90 0,3.2 0,3.3 0,86.9 arc-90 3.2,90.1 3.5,90.1 5.2,90.1 arc90 5.3,90 75.8,90 arc-90 78.9,86.9 78.9,86.8 arc-90 79,86.7
  pour Bottom (rank 6, hatched): 79,5.2 arc-90 79.1,5.1 79.1,2.1 arc-90 76.9,-0.1 75.1,-0.1 3.2,-0.1 arc-90 0,3.1 0,3.2 0,86.8 arc-90 3.2,90 3.5,90 5.2,90 arc90 5.3,89.9 75.8,89.9 arc-90 78.9,86.8 78.9,86.7 arc-90 79,86.6
CHASSIS  (via drill 0.35)
  Top 0.16: H1.1 H1.V6 | H1.V9 3.71,85 3,85.71 H1.1 | H1.1 2.49,87 H1.V5 | H1.1 3,88.48 H1.V4 H1.V3 | H1.1 4.35,88.35 H1.V2 | H1.1 H1.V1 | H1.1 3.51,87 H1.V10 | H1.1 1.65,85.65 H1.V7 | 25.5,46.48 H6.V3 | H6.1 26.85,46.35 H6.V2 27.8,45.91 H6.V1 | H6.1 25.5,46.48 | 25.5,46.48 H6.V4 | H6.1 24.15,43.65 H6.V7 | H6.1 H6.V6 | 25.5,43.52 H6.V9 | H6.1 25.5,43.52 | 25.5,43.52 H6.V8 | H6.1 26.01,45 H6.V10 | H6.1 24.15,46.35 H6.V5 | H12.1 76,4.48 H12.V3 | H12.V3 75.5,5.19 H12.V4 | H12.V3 77.03,5.19 H12.V2 | H12.V2 78.3,3.91 H12.V1 78.3,2.09 H12.V10 | H12.1 76.71,2.29 H12.V9 | H12.1 76,1.52 H12.V8 | H12.1 75.49,3 H12.V7 | H12.1 H12.V6 | H12.1 77.35,4.35 H12.V2 | H11.1 1.65,4.35 H11.V5 | H11.1 2.29,3.71 H11.V4 | H11.1 3,4.48 H11.V3 | H11.1 4.35,4.35 H11.V2 | H11.1 H11.V1 | H11.1 H11.V6 | H11.1 1.65,1.65 H11.V7 | H11.1 3.71,2.29 H11.V9 | H11.1 3,1.52 H11.V8 | H11.1 4.35,1.65 H11.V10 | v64.5,27 66.81,29.31 66.81,30 66.81,43.31 72.5,49 v72.5,74 | v53.5,38 53.86,38.36 54.7,38.36 55.09,38.75 55.09,39.55 54.25,40.39 C10.1 | 53.5,46.48 H7.V3 | H7.1 54.85,46.35 H7.V2 | H7.1 H7.V1 | H7.1 H7.V6 | H7.1 52.99,45 H7.V5 | H7.1 53.5,46.48 | 53.5,46.48 H7.V4 | H7.1 52.15,43.65 H7.V7 | H6.1 28.47,42.03 v28.47,41.97 | H1.1 3,85.52 H1.V8 | H7.1 54.4,44.1 54.4,43 | 21.15,45.85 C9.1
  Top 0.2: v9.5,23 10.05,23 R15.2 C13.1 10.2,26.3 v9.5,27 | v8.5,21 8.5,8.5 H11.1 | 54.4,43 54.25,42.85 C10.1 R12.2 | H6.1 24.7,45.8 C9.1 R11.2 22,43.15 v22,42.75 | H12.1 73.05,5.95 R14.2 73.05,27.55 v73.5,28 | C11.1 72.65,34.8 72.65,30.15 v72.5,30 70.05,30 C12.1 | R13.2 C12.1 | R1.2 C4.1 | H1.1 3,81.65 12.4,72.25 R1.2 | H7.1 53.5,43.52 H7.V8 | 66.81,30 67.3,29.51 67.76,29.51 68.47,28.8 C12.1 | H7.1 54.85,43.65 H7.V10 | H12.V5 74.97,5.19 75.5,5.19 | H7.1 54.21,44.29 H7.V9 | R1.2 v13.5,72.25 | v15.35,45.85 17.02,45.85 18.03,46.87 18.04,46.87 19.19,48.02 19.19,48.76 19.34,48.91 22.42,48.91 23.09,48.24 23.09,47.76 22.74,47.41 22.71,47.41 21.15,45.85
  Bottom 0.16: H2.1 77.35,88.35 H2.V2 | H2.1 76.71,87.71 H2.V3 | H2.1 76,88.48 H2.V4 | H2.1 74.65,88.35 H2.V5 | H2.1 H2.V6 | H2.1 74.65,85.65 H2.V7 | H2.1 75.29,86.29 H2.V8 | H2.1 76,85.52 H2.V9 | H2.1 77.35,85.65 H2.V10 | H2.1 H2.V1 | H2.1 76,77.5 v72.5,74 | v64.5,27 55.5,27 53.5,29 v53.5,38 51.78,38 41.55,27.77 37.45,27.77 33.94,31.29 33.94,36.5 v28.47,41.97
  Bottom 0.2: v9.5,23 9.5,22 v8.5,21 | v73.5,28 73.5,29 v72.5,30 | v13.5,72.25 13.5,65.8 13.47,65.8 11.91,64.24 11.91,47.59 13.65,45.85 v15.35,45.85 | v9.5,27 22,39.5 v22,42.75
DCAP
  Top 0.2: C2.1 20.8,70.55 U1.8
DEPLOYABLE  (via drill 0.35)
  Top 0.5: R8.2 8.5,58.36 | 8.5,58.36 5.5,55.36 v5.5,32 | v8.5,32 10.25,32 J1.1 J1.2 | R9.2 70.41,75.09 58.5,87 v20.5,87 | v8.5,63 8.5,58.36
  Bottom 0.5: v5.5,32 v8.5,32 | v8.5,63 8.5,72.92 12.25,76.68 12.25,78.75 v20.5,87
DGND  (via drill 0.35)
  Top 0.16: 16.91,45.24 16.89,45.22 16.89,28.48 16.5,28.08 16.5,28.05 | U1.PAD 20.82,68.08 23.71,65.19 24.85,65.19 25.16,64.88 v25.16,62.57 | C5.2 22.75,63 23.28,63 v23.91,62.36
  Top 0.2: R4.1 R5.1 16.5,66.75 v16.5,66.97 | v17.5,70 18.96,70 20.25,68.71 20.25,68.5 20.68,68.08 20.82,68.08 | U1.PAD 20.8,68.62 20.3,69.12 U1.9 | v22.5,48 21.01,46.51 18.18,46.51 16.91,45.24 | J4.4 16.5,28.05 | v23.5,50 23.7,50.2 R10.2 23.85,52.65 v22.5,54 | C5.2 22.6,55.9 v23.5,55
  Bottom 0.16: v23.91,62.36 24.95,62.36 v25.16,62.57
  Bottom 0.2: v16.5,66.97 16.5,69 v17.5,70 | v22.5,48 22.5,49 v23.5,50 | v23.5,55 v22.5,54
GPS_COAX
  Top 0.3: J2.CENTER 61.5,34.2
  Top 1.5: AE1.CENTER 42.25,69.25 arc-90 61.5,50 61.5,34.2
  pour Top (no thermals): 60.85,35 60.85,33.69 arc45 60.95,33.45 60.95,33.45 arc-45 61.1,33.09 61.1,32.1 61.9,32.1 61.9,33.09 arc-45 62.05,33.45 62.05,33.45 arc45 62.15,33.69 62.15,35
I2C_SCL_ADCS  (via drill 0.35)
  Top 0.16: J4.2 15.5,21.25 R16.1 14.07,22.68 14.07,23.23 13.73,23.57 13.27,23.57 12.69,22.99 12.49,22.99 v11.5,22 | U1.15 13.36,61.56 13.27,61.56 11.18,59.48 11.18,56.68 8.5,54 8.5,42.8 7.93,42.23 7.93,38.12 8.5,37.56 v8.5,37
  Bottom 0.16: v11.5,22 11.5,23.69 10.35,24.85 7.91,24.85 7.28,25.47 7.28,29.22 9.07,31 9.07,36.44 v8.5,37
I2C_SDA_ADCS
  Top 0.16: U1.14 18.1,67.6 16.69,66.19 16.69,65.85 10.86,60.02 10.86,59.19 9.16,57.49 9.16,57.48 8.18,56.5 8.18,42.93 7.57,42.33 7.57,30.93 8.93,29.56 8.93,22.77 10.27,21.43 11.52,21.43 R17.1 14.6,19.75 J4.1
LOW_GAIN_COAX
  Top 1: J3.CENTER 59.9,23 59.6,22.7 59.6,22.65 Z1.6
  pour Top (no thermals): 63.9,23.4 63.68,23.4 arc-45 63.2,23.6 arc45 62.72,23.8 60.4,23.8 58.1,22.9 58.7,21.4 60.89,22.26 arc-21 62.71,22.6 63.9,22.6
LOW_GAIN_N
  Top 1.5: J6.1 42.33,9 arc45 47.4,11.1 50.31,14.02 arc-45 53.9,15.5 55.5,15.5 arc-45 56.71,16 Z1.3
LOW_GAIN_P
  Top 1.5: J5.1 arc-90 40.5,11 42.4,11 arc45 45.81,12.41 53.29,19.89 arc-45 54.55,20.41 Z1.1
PD_RST  (via drill 0.35)
  Top 0.2: R6.1 23.72,64.65 22.91,65.46 v22.58,65.46 | U1.17 20.3,65.25 v20.21,65.17
  Bottom 0.2: v20.21,65.17 20.44,65.39 21.3,65.39 21.37,65.46 v22.58,65.46
PGND  (via drill 0.35)
  Top 0.16: C10.2 53.39,39.86 52.05,39.86 50.26,41.65 50.26,46.34 52.16,48.24 54.84,48.24 56.74,46.34 56.74,43.66 56.5,43.42 56.5,29 58.5,27 63.7,27 64.27,26.43 64.73,26.43 65.3,27 R13.1
  Top 0.2: R15.1 C13.2 7.91,31.13 7.91,32.24 8.5,32.83 8.5,35 9.75,36.25 J1.4
  Top 0.5: R8.1 8.86,42 v8.5,42 8.5,38.25 J1.4 | 2.5,47 2.5,62.45 C4.2 R1.1 v12.5,64 | v17.5,45 18.3,45.8 C9.2 R11.1 22.65,41 27.5,41 29.19,39.31 35.3,39.31 35.62,39 R12.1 C10.2 | R9.1 73.25,38.89 C11.2 73.25,29.3 71.55,27.6 R14.1 68.25,26.1 R13.1 C12.2 | H5.1 H5.V2 3.16,46.6 H5.V3 | H5.1 H5.V1 | H5.1 H5.V8 | H5.1 H5.V5 | 2.5,47 1.63,46.13 H5.V4 H5.1 | H5.1 2.5,47 | v3.5,42 2.5,43 H5.V7 H5.1 | H5.1 H5.V6
  Bottom 0.16: 61.1,80.4 61,80.5 60.9,80.4 | 61.1,80.4 68.59,72.91 R9.1 | H4.1 H4.V1 61.1,80.4 | H4.1 H4.V7 | 58.5,81 H4.V6 | H4.1 H4.V5 | H4.1 H4.V3 | H4.1 H4.V2
  Bottom 0.2: 61,80.5 H4.V8 H4.1 | 60.9,80.4 H4.V7 | H4.1 58.5,81 | H4.V6 58.37,81.53 H4.V5 | H4.1 H4.V4
  Bottom 0.5: v8.5,42 v3.5,42 | v12.5,64 12.5,50 v17.5,45
PHOTO  (via drill 0.35)
  Top 0.2: R7.2 31.85,53.65 31.5,54 31.75,54 D1.A 29.34,56.41 27.26,56.41 26.67,57 v26.5,57 | U1.18 20.8,65 20.8,64.3 v20.5,64
  Bottom 0.2: v20.5,64 20.5,63 v26.5,57
RFGND-0  (via drill 0.35)
  Top 0.3: v47.5,17 v49.5,19 v51.5,21 v53.5,23 v55.5,25 v59.5,25 v63.5,25 64.5,25 65,24.5 J3.SHIELD@1 | v47.5,17 v45.5,15 v43.5,13 v39.5,13 v37.5,11 v35.5,9 v33.5,7 H9.V4 H9.1 | v33.5,11 v35.5,13 v37.5,15 v39.5,17 v43.5,17 | v43.5,17 v47.5,17 | v41.5,15 v43.5,17 | v51.5,13 v49.5,11 v47.5,9 v45.5,7 H10.V2 H10.1 | v55.5,13 v53.5,11 v51.5,9 v49.5,7 v47.5,5 47,4.5 H10.V1 H10.1 | v49.5,3 v51.5,5 v53.5,7 v55.5,9 v57.5,11 v59.5,13 v61.5,15 | v61.5,15 v63.5,17 v65.5,19 65,19.5 J3.SHIELD@13 | v61.5,15 v59.5,17 60.4,17.9 Z1.4 | v63.5,21 64,21.5 64.97,21.5 J3.SHIELD@13 | J3.SHIELD@13 65,23 | 65,23 J3.SHIELD@1 | J3.SHIELD@1 65.03,24.5 67,24.5 v67.5,25 | J3.SHIELD@2 65,23 | v67.3,21.1 66.9,21.5 65.03,21.5 J3.SHIELD@13 | H10.1 H10.V3 | H10.1 H10.V4 | H10.1 H10.V5 H9.1 | H10.1 H10.V6 | H10.1 H10.V7 | H10.1 H10.V8 | H9.1 H9.V1 | H9.1 H9.V2 | H9.1 H9.V3 | H9.1 H9.V5 | H9.1 H9.V6 | H9.1 H9.V7 | H9.1 H9.V8
  pour Top (isolate 0.5, rank 2, no thermals): 36,1.3 arc-90 32.8,4.5 32.8,9.13 arc-45 34.26,12.66 38.12,16.52 arc-45 40.24,17.4 44.66,17.4 arc45 46.78,18.28 53.52,25.02 arc-45 55.64,25.9 67.1,25.9 arc-90 68.1,24.9 68.1,23.37 arc-45 66.64,19.84 48.98,2.18 arc-45 46.86,1.3
  pour Bottom (isolate 0.5, rank 2, no thermals): 36,1.3 arc-90 32.8,4.5 32.8,9.13 arc-45 34.26,12.66 38.12,16.52 arc-45 40.24,17.4 44.66,17.4 arc45 46.78,18.28 53.52,25.02 arc-45 55.64,25.9 67.1,25.9 arc-90 68.1,24.9 68.1,23.37 arc-45 66.64,19.84 48.98,2.18 arc-45 46.86,1.3
RFGND-1  (via drill 0.3)
  Top 0.3: v61.5,31 J2.SHIELD@13 | J2.SHIELD@13 v57.5,31 v57.5,35 v57.5,39 v57.5,43 v57.5,47 | J2.SHIELD@1 v65.5,31 v65.5,35 v65.5,39 v65.5,43 v65.5,47 v65.5,51 v65.5,55 v65.5,59 v65.5,63 v65.5,67 | J2.SHIELD@1 v61.5,31 | v61.5,31 J2.SHIELD@2 | J2.SHIELD@1 62.98,29.52 v63.5,29 | J2.SHIELD@13 60.02,29.52 v59.5,29 | J2.SHIELD@13 60.02,32.48 v59.5,33 v59.5,37 v59.5,41 v59.5,45 v59.5,49 v59.5,53 | J2.SHIELD@1 62.98,32.48 v63.5,33 v63.5,37 v63.5,41 v63.5,45 v63.5,49 v63.5,53 v63.5,57 | v63.5,57 v63.5,61 v63.5,65 v63.5,69 v63.5,73 | v57.5,59 v57.5,55 v57.5,51 v57.5,47 | v57.5,47 v55.5,49 | v55.5,49 v53.5,51 | v53.5,51 v51.5,53 | v51.5,53 v49.5,55 | v49.5,55 v47.5,57 | v47.5,57 v45.5,59 | v45.5,59 v43.5,61 | v43.5,61 v41.5,59 | v41.5,59 v39.5,61 | v39.5,61 v37.5,59 | v37.5,59 v35.5,61 | v35.5,61 v33.5,59 | v33.5,59 v31.5,61 | v31.5,61 v29.5,59 | v29.5,59 v27.5,61 v27.5,65 v27.5,69 v27.5,73 v27.5,77 v27.5,81 | v29.5,83 v29.5,79 v29.5,75 v29.5,71 v29.5,67 v29.5,63 v29.5,59 | v31.5,61 v31.5,65 v31.5,69 v31.5,73 v31.5,77 v31.5,81 | v33.5,83 v33.5,79 v33.5,75 v33.5,71 v33.5,67 v33.5,63 v33.5,59 | v35.5,61 v35.5,65 v35.5,69 v35.5,73 v35.5,77 v35.5,81 | v37.5,83 v37.5,79 v37.5,75 v37.5,71 v37.5,67 v37.5,63 v37.5,59 | v39.5,61 v39.5,65 v39.5,69 AE1.GND | AE1.GND v39.5,73 v39.5,77 v39.5,81 | v41.5,83 v41.5,79 v41.5,75 v41.5,71 AE1.GND | v41.5,67 v41.5,63 v41.5,59 | v43.5,61 v43.5,65 | v45.5,67 v45.5,63 v45.5,59 | v47.5,65 v47.5,61 v47.5,57 | v49.5,63 v49.5,59 v49.5,55 | v51.5,65 v51.5,61 v51.5,57 v51.5,53 | v53.5,63 v53.5,59 v53.5,55 v53.5,51 | v55.5,61 v55.5,57 v55.5,53 v55.5,49 | v43.5,81 v43.5,77 v43.5,73 v45.5,71 | v45.5,83 v45.5,79 v45.5,75 v45.5,71
  Top 0.3: v45.5,71 v47.5,73 | v47.5,73 v49.5,71 | v49.5,71 v51.5,69 | v51.5,69 v53.5,71 | v53.5,71 v55.5,69 | v55.5,69 v57.5,67 | v57.5,67 v59.5,65 | v59.5,65 v61.5,63 | v61.5,63 v61.5,59 v63.5,57 | v61.5,63 v61.5,67 v61.5,71 v61.5,75 | v59.5,77 v59.5,73 v59.5,69 v59.5,65 | v57.5,67 v57.5,71 v57.5,75 v57.5,79 | v55.5,81 v55.5,77 v55.5,73 v55.5,69 | v53.5,79 v53.5,75 v53.5,71 | v51.5,69 v51.5,73 v51.5,77 v51.5,81 | v49.5,83 v49.5,79 v49.5,75 v49.5,71 | v47.5,73 v47.5,77 v47.5,81
  pour Top (isolate 0.5, rank 2, no thermals): 26.6,60 26.6,80.5 arc-90 30,83.9 46.5,83.9 arc-90 66.4,64 66.4,31.3 62.9,27.8 60.1,27.8 57.1,30.8 57.1,45.01 arc45 56.05,47.55 46.55,57.05 arc45 44.01,58.1 28.5,58.1 arc-90
  pour Bottom (isolate 0.5, no thermals): 26.6,60 26.6,80.5 arc-90 30,83.9 46.5,83.9 arc-90 66.4,64 66.4,31.3 62.9,27.8 60.1,27.8 57.1,30.8 57.1,45.01 arc45 56.05,47.55 46.55,57.05 arc45 44.01,58.1 28.5,58.1 arc-90
SENSE  (via drill 0.35)
  Top 0.2: J1.3 10.5,35.08 11.52,36.1 11.52,59.02 v13.5,61
  Bottom 0.16: H3.1 H3.V8 | H3.1 H3.V1 | H3.1 H3.V2 | H3.1 H3.V3 | H3.1 23.5,86 59.5,86 76.5,69 H8.1 | H8.1 H8.V1 | H8.1 H8.V8 | H8.1 H8.V7 | H8.1 H8.V6 | H8.1 H8.V5 | H3.1 H3.V4 | H3.1 H3.V7 | H3.1 H3.V5 | H8.1 H8.V2 | H8.1 H8.V4 | H3.1 H3.V6 | H8.1 H8.V3
  Bottom 0.2: v13.5,61 14.23,61.73 14.23,76.72 18,80.5 19.4,80.5 H3.V7
THERM-0  (via drill 0.35)
  Top 0.2: RN1.6 28.1,38.4 v27.5,39 | v13.5,51 13.5,49.45 RT3.2 14.5,49.25 14.75,49.5 v14.75,50.75 | U1.19 21.3,56.8 v20.5,56
  Bottom 0.2: v27.5,39 27.5,42.39 28.76,43.65 28.76,46.35 24.3,50.8 24.11,51 23.91,51.2 21.96,51.2 21.91,51.25 15.25,51.25 v14.75,50.75 | v20.5,56 18.99,56 18.82,56.17 17.24,56.17 16.46,55.39 16.46,53.96 v13.5,51
THERM-1  (via drill 0.35)
  Top 0.2: v36.5,40 35.39,41.1 35.39,42.21 35.24,42.36 35.22,42.36 21.8,55.78 U1.20 | v34.5,36 33.33,36 RN1.7 | RT4.2 46.5,36 v45.5,37
  Bottom 0.2: v36.5,40 36.5,38 | 36.5,38 v34.5,36 | 36.5,38 36.95,37.55 41.22,37.55 41.77,37 43.09,37 43.26,36.83 43.74,36.83 43.91,37 v45.5,37
THERM-2  (via drill 0.35)
  Top 0.2: RN1.8 32.97,37.64 42.11,37.64 | RT7.2 42.11,37.64 | U1.1 23.15,66.65 23.15,66.55 v23.61,66.09 | 42.11,37.64 43.27,37.64 v43.5,37.41 | v45.31,42 45.31,44.37 45.9,44.95 45.9,50.19 42.19,53.9 36.95,53.9 36.14,53.09 33.31,53.09 32.96,52.74 31.34,52.74 29.08,55 v28.5,55 | v25.67,55.09 25.16,55.59 v25.16,59.17
  Bottom 0.2: v25.16,59.17 25.16,61.17 25.74,61.76 25.74,63.95 v23.61,66.09 | v43.5,37.41 45.31,39.23 v45.31,42 | v28.5,55 25.76,55 v25.67,55.09
THERM-3  (via drill 0.35)
  Top 0.16: v32.5,35 34.62,32.88 34.62,30.6 37.45,27.77 46.61,27.77 49.29,30.45 49.29,31.55 48.75,32.09 RT6.2 | v30.5,43 30.93,43
  Top 0.2: v30.5,48 27.01,51.49 27.01,54.71 25.74,55.97 25.74,64.9 23.04,67.6 U1.2 | v30.5,46 30.93,45.57 30.93,43 RN1.4
  Bottom 0.16: v30.5,43 30.03,42.53 28.23,42.53 27.9,42.2 27.9,39.6 v32.5,35
  Bottom 0.2: v30.5,48 v30.5,46
THERM-4  (via drill 0.35)
  Top 0.2: U1.3 v23.5,68.1 24.11,68.1 24.29,68.28 24.29,69.46 24.41,69.58 v24.41,70 | RN1.3 32.2,44.31 v31.52,45 | RT1.2 18.25,73.25 v18.5,73
  Bottom 0.2: v31.52,45 31.1,45.41 30.26,45.41 24.11,51.56 22.11,51.56 21.77,51.91 21.77,52.39 24.73,55.35 24.73,55.48 25.09,55.84 25.09,57.91 18.91,64.08 18.91,64.7 19.97,65.75 21.16,65.75 v23.5,68.1 | v24.41,70 24.41,72.91 23.74,73.59 23.26,73.59 22.67,73 v18.5,73
THERM-5  (via drill 0.35)
  Top 0.2: v39.5,38.23 39.73,38 52.27,38 53.5,36.77 RT5.2 | v33.5,43 33.5,41.63 RN1.2 | U1.4 23.14,68.6 v23.54,69 | v25.91,66.73 25.91,66.41 26.11,66.22 26.11,58.39 26.91,57.59 v28.57,57.59
  Bottom 0.2: v23.54,69 24.12,68.41 25.09,68.41 25.5,68.83 25.98,68.83 26.33,68.48 26.33,67.47 25.91,67.05 v25.91,66.73 | v28.57,57.59 33.1,53.05 33.1,45.4 33.5,45 v33.5,43 34.73,43 36.14,41.59 36.74,41.59 37.45,40.88 37.45,40.28 v39.5,38.23
THERM-6  (via drill 0.35)
  Top 0.2: RN1.1 34.5,41.84 v34.5,42 | v25.5,66 24.98,66.53 24.98,67.47 RT2.2 25.16,67.66 25.98,67.66 26.33,68 26.33,68.48 26.3,68.52 v26.3,69.35 | U1.5 22.7,69.2 v23.5,70
  Bottom 0.2: v34.5,42 34.09,42.41 33.26,42.41 32.1,43.57 32.1,53.23 26.11,59.22 26.11,65.39 v25.5,66 | v23.5,70 23.59,70 24.17,69.41 26.23,69.41 v26.3,69.35

### Text on the board
tNames: +X Panel V1.1 | AVREF / UNBUF | AVDD